# EAGLE design Flat Back Eurorack Busboard Small (EAGLE 7.2.0)
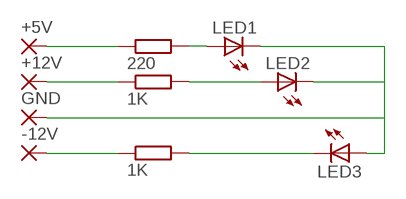
[diagram p0: schematic, sheet 1]

## Parts
+5V  SMD5  [SMD2,54-5,08]
+12V  SMD5  [SMD2,54-5,08]
-12V  SMD5  [SMD2,54-5,08]
GND  SMD5  [SMD2,54-5,08]
LED1  LEDCHIPLED_0805  [CHIPLED_0805]
LED2  LEDCHIPLED_0805  [CHIPLED_0805]
LED3  LEDCHIPLED_0805  [CHIPLED_0805]
R1  220  R-EU_M0805  [M0805]
R2  1K  R-EU_M0805  [M0805]
R3  1K  R-EU_M0805  [M0805]

## Nets
+5V: +5V.1(P) R1.1
+12V: +12V.1(P) R2.1
-12V: -12V.1(P) R3.1
GND: GND.1(P) LED1.C LED2.C LED3.A
N$13: LED1.A R1.2
N$14: LED2.A R2.2
N$15: LED3.C R3.2

## Library data of the parts
+5V +12V -12V GND = wirepad:SMD5: SMD PAD
LED1-LED3 = adafruit:LED: LED OSRAM: - CHIPLED LG R971, LG N971, LY N971, LG Q971, LY Q971, LO R971, LY R971 LH N974, LH R974 LS Q976, LO Q976, LY Q976 LO Q996 - Hyper CHIPLED LW Q18S LB Q993, LB Q99A, LB R99A - SideLED LS A670, LO A670, LY A670, LG A670, LP A670 LB A673, LV A673, LT A673, LW A673 LH A674 LY A675 LS A676, LA A676, LO A676, LY A676, LW A676 LS A679, LY A679, LG A679 - Hyper Micro SIDELED® LS Y876, LA Y876, LO Y876, LY Y876 LT Y87S - SmartLED LW L88C, LW L88S LB L89C, LB L89S, LG L890 LS L89K, LO L89K, LY L89K LS L896, LA L896, LO L896, LY L896 - TOPLED LS T670, LO T670, LY T670, LG T670, LP T670 LSG T670, LSP T670, LSY T670, LOP T670, LYG T670 LG T671, LOG T671, LSG T671 LB T673, LV T673, LT T673, LW T673 LH T674 LS T676, LA T676, LO T676, LY T676, LB T676, LH T676, LSB T676, LW T676 LB T67C, LV T67C, LT T67C, LS T67K, LO T67K, LY T67K, LW E67C LS E67B, LA E67B, LO E67B, LY E67B, LB E67C, LV E67C, LT E67C LW T67C LS T679, LY T679, LG T679 LS T770, LO T770, LY T770, LG T770, LP T770 LB T773, LV T773, LT T773, LW T773 LH T774 LS E675, LA E675, LY E675, LS T675 LS T776, LA T776, LO T776, LY T776, LB T776 LHGB T686 LT T68C, LB T68C - Hyper Mini TOPLED® LB M676 - Mini TOPLED Santana® LG M470 LS M47K, LO M47K, LY M47K Source: http://www.osram.convergy.de/
R1-R3 = resistor:R-EU_: RESISTOR, European symbol

## Board
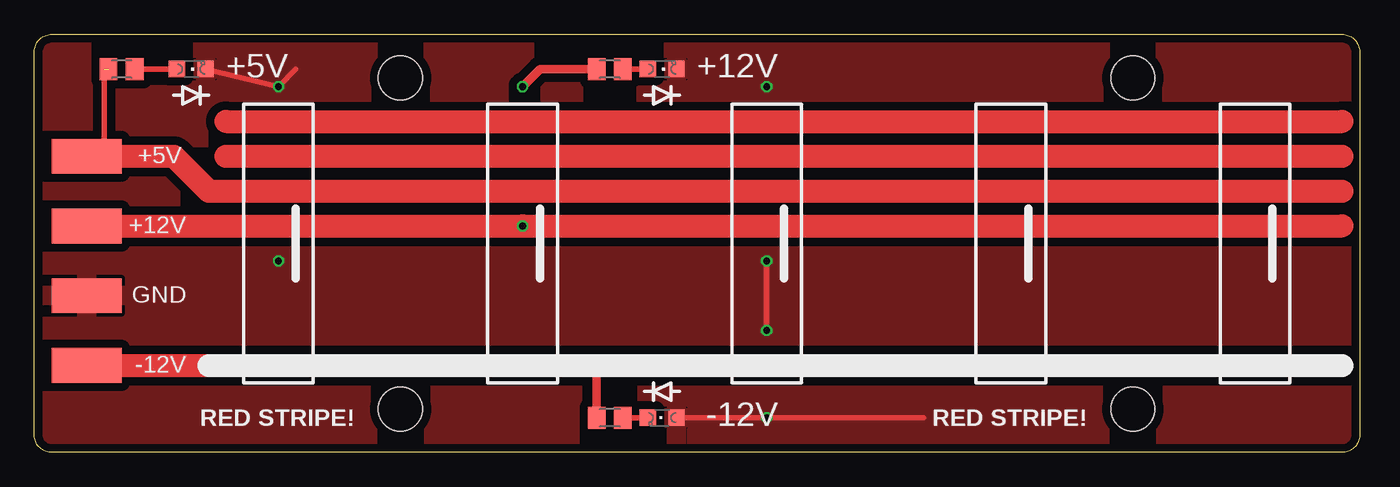
[diagram p1: board, top side]
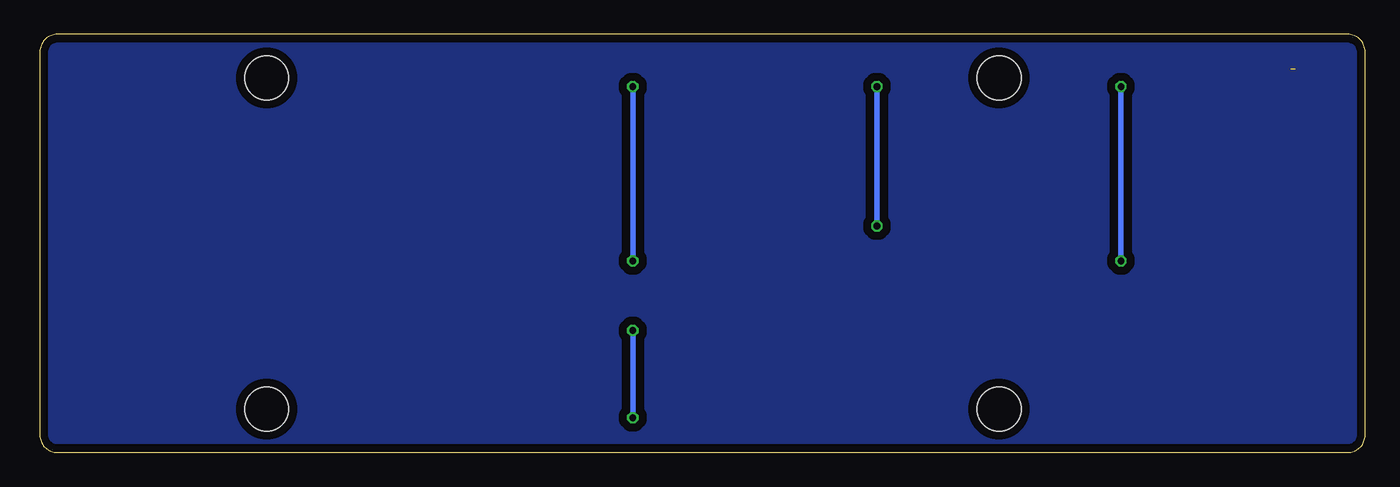
[diagram p2: board, bottom side, seen from below]

Size 96.52 x 30.48 mm. Coordinates in mm from the lower left corner, seen from the top.
Outline: 0,1.27 0,29.21 arc-90 1.27,30.48 95.25,30.48 arc-90 96.52,29.21 96.52,1.27 arc-90 95.25,0 1.27,0 arc-90 0,1.27
Copper layers (1*16): Top 0.035mm / dielectric 1.5mm / Bottom 0.035mm
Design rules "dirt_cheap_dirty_boards.v1": minimum track width 5mil, minimum drill 12mil, track to track 5mil, track to pad 5mil, pad to pad 5mil, via to via 5mil, smd to smd 0mil, copper to edge 10mil, drill to drill 10mil, minimum pad ring 10mil, minimum via ring 6mil, stop-mask expansion 2mil, vias tented up to drill 25mil, thermal gap 10mil
Holes 3.2 mm at 26.67,3.17 26.67,27.3 80.01,3.17 80.01,27.3

### Footprints (pad centres in the part's own frame; a part is rotated, then mirrored left to right if it is on the bottom)
SMD2,54-5,08 = smd 2.54 x 5.08: 1 0,0
CHIPLED_0805 = smd 1.2 x 1.2: A 0,-1.05; C 0,1.05
M0805 = smd 1.3 x 1.6: 1 -0.95,0; 2 0.95,0

### Placement (x,y rotation side)
+5V  3.81,21.59 90 top
+12V  3.81,16.51 90 top
-12V  3.81,6.35 90 top
GND  3.81,11.43 90 top
LED1  11.43,27.94 270 top
LED2  45.72,27.94 270 top
LED3  45.72,2.54 90 top
R1  6.35,27.94 0 top
R2  41.91,27.94 0 top
R3  41.91,2.54 0 top

### Tracks (layer width: path | path; a pad name or v marks a point on that pad's centre or on a via)
+5V  (1 unrouted)
  Top 0.406: 5.08,27.94 5.08,22.86 +5V.1
  Top 1.676: +5V.1 10.16,21.59 12.7,19.05 95.25,19.05
+12V  (via drill 0.5)
  Top 0.61: v35.56,26.67 36.83,27.94 R2.1
  Top 1.676: +12V.1 v35.56,16.51 95.25,16.51
  Bottom 0.406: v35.56,16.51 v35.56,26.67
-12V
  Top 0.61: R3.1 40.96,6.03 40.64,6.35
  Top 1.676: -12V.1 40.64,6.35 94.93,6.35
GND  (via drill 0.5)
  Top 0.406: v53.34,8.89 v53.34,13.97 | LED3.A v53.34,2.54 64.77,2.54 | LED1.C v17.78,26.67 19.05,27.94
  Bottom 0.406: v17.78,13.97 v17.78,26.67 | v53.34,2.54 v53.34,8.89 | v53.34,13.97 v53.34,26.67
  pour Top (isolate 0.61): 0,0 0,30.48 96.52,30.48 96.52,0
N$1
  Top 1.676: 13.97,21.59 95.25,21.59
N$7
  Top 1.676: 13.97,24.13 95.25,24.13
N$13
  Top 0.406: R1.2 LED1.A
N$14
  Top 0.406: LED2.A R2.2
N$15
  Top 0.406: R3.2 LED3.C
N$16
  pour Bottom (isolate 0.61): 0,0 0,30.48 96.52,30.48 96.52,0

### Text on the board
tPlace: RED STRIPE! | RED STRIPE!
tNames: +5V | +12V | -12V